# EAGLE schematic trig3_board_de0-nano_lvds (EAGLE 9.6.2)
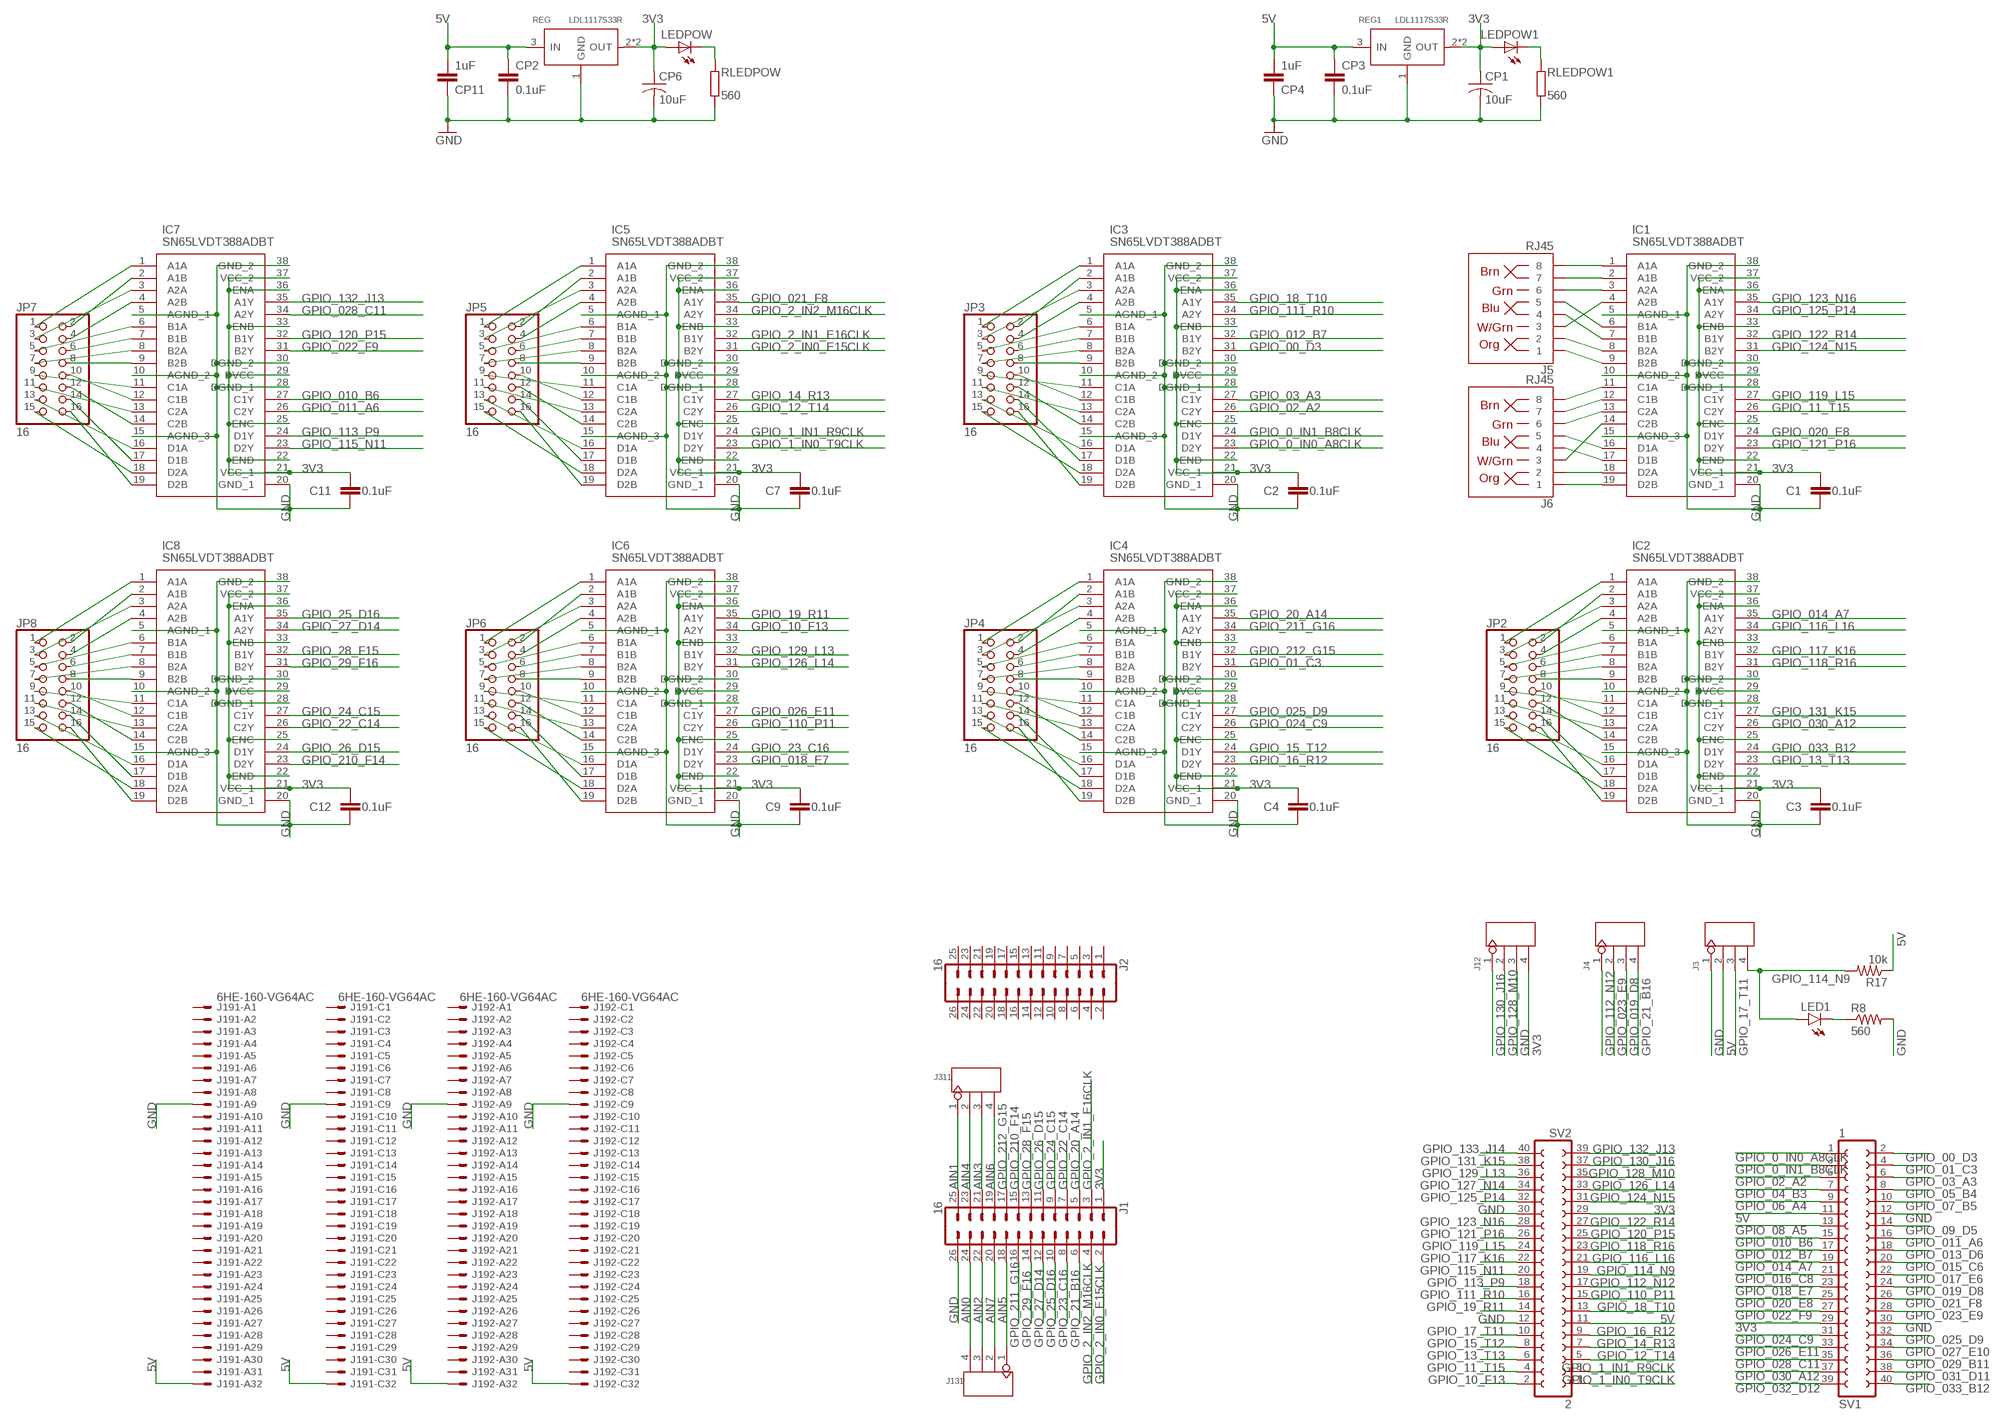
[diagram p0: schematic, sheet 1, part 1 of 2]
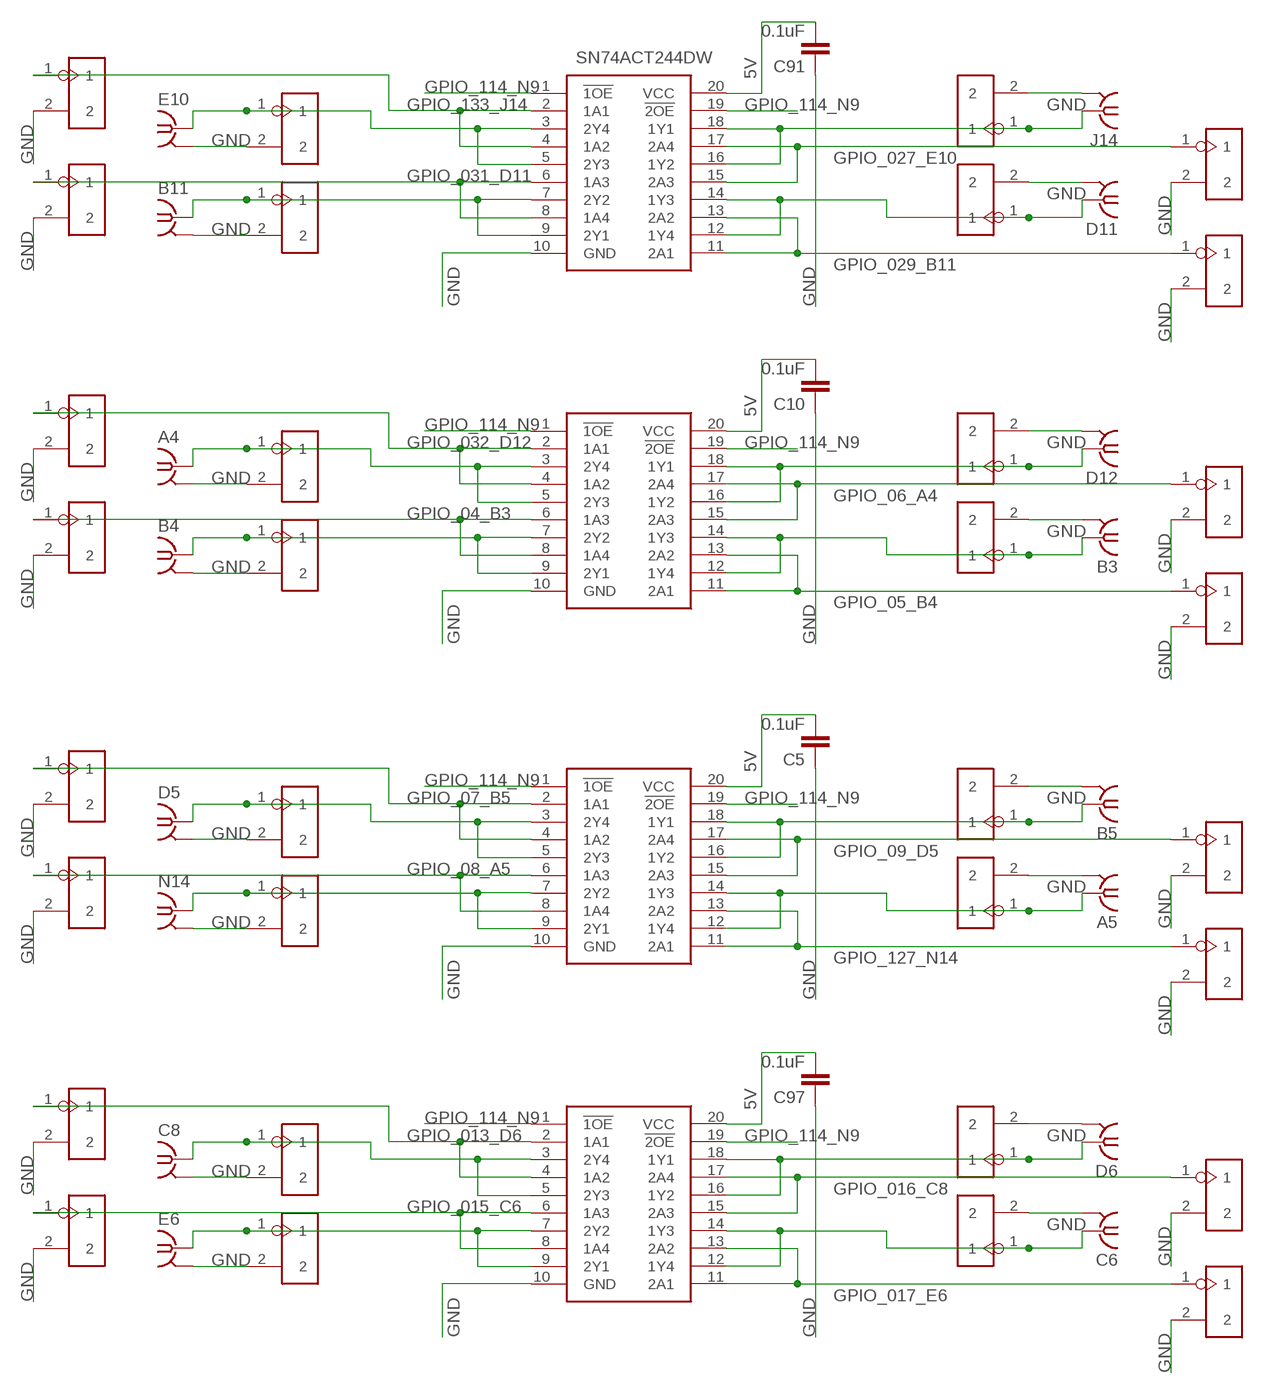
[diagram p1: schematic, sheet 1, part 2 of 2]

## Parts
A4  BU-SMB-V  [BU-SMB-V]
A5  BU-SMB-V  [BU-SMB-V]
B3  BU-SMB-V  [BU-SMB-V]
B4  BU-SMB-V  [BU-SMB-V]
B5  BU-SMB-V  [BU-SMB-V]
B11  BU-SMB-V  [BU-SMB-V]
C1  0.1uF  CAP0805  [0805]
C2  0.1uF  CAP0805  [0805]
C3  0.1uF  CAP0805  [0805]
C4  0.1uF  CAP0805  [0805]
C5  0.1uF  CAP0805  [0805]
C6  BU-SMB-V  [BU-SMB-V]
C7  0.1uF  CAP0805  [0805]
C8  BU-SMB-V  [BU-SMB-V]
C9  0.1uF  CAP0805  [0805]
C10  0.1uF  CAP0805  [0805]
C11  0.1uF  CAP0805  [0805]
C12  0.1uF  CAP0805  [0805]
C91  0.1uF  CAP0805  [0805]
C97  0.1uF  CAP0805  [0805]
CP1  10uF  C-USC1206  [C1206]
CP2  0.1uF  C-EUC0805K  [C0805K]
CP3  0.1uF  C-EUC0805K  [C0805K]
CP4  1uF  C-EUC0805K  [C0805K]
CP6  10uF  C-USC1206  [C1206]
CP11  1uF  C-EUC0805K  [C0805K]
D5  BU-SMB-V  [BU-SMB-V]
D6  BU-SMB-V  [BU-SMB-V]
D11  BU-SMB-V  [BU-SMB-V]
D12  BU-SMB-V  [BU-SMB-V]
E6  BU-SMB-V  [BU-SMB-V]
E10  BU-SMB-V  [BU-SMB-V]
IC1  SN65LVDT388ADBT  [SOP50P640X120-38N]
IC2  SN65LVDT388ADBT  [SOP50P640X120-38N]
IC3  SN65LVDT388ADBT  [SOP50P640X120-38N]
IC4  SN65LVDT388ADBT  [SOP50P640X120-38N]
IC5  SN65LVDT388ADBT  [SOP50P640X120-38N]
IC6  SN65LVDT388ADBT  [SOP50P640X120-38N]
IC7  SN65LVDT388ADBT  [SOP50P640X120-38N]
IC8  SN65LVDT388ADBT  [SOP50P640X120-38N]
J1  16  M13X22X13  [2X13]
J2  16  M13X22X13  [2X13]
J3  4p-2.54  DIP-BLACK-FEMALE-HEADER-VERT(4P-2.54)  [H4-2.54]
J4  4p-2.54  DIP-BLACK-FEMALE-HEADER-VERT(4P-2.54)  [H4-2.54]
J5  RJ45  RJ45-8PTH  [RJ45-8]
J6  RJ45  RJ45-8PTH  [RJ45-8]
J12  4p-2.54  DIP-BLACK-FEMALE-HEADER-VERT(4P-2.54)  [H4-2.54]
J14  BU-SMB-V  [BU-SMB-V]
J19  6HE-160-VG64AC  [6HE_160-VG64AC]
J131  4p-2.54  DIP-BLACK-FEMALE-HEADER-VERT(4P-2.54)  [H4-2.54]
J311  4p-2.54  DIP-BLACK-FEMALE-HEADER-VERT(4P-2.54)  [H4-2.54]
JP2  16  PINHD-2X8/90  [2X08/90]
JP3  16  PINHD-2X8/90  [2X08/90]
JP4  16  PINHD-2X8/90  [2X08/90]
JP5  16  PINHD-2X8/90  [2X08/90]
JP6  16  PINHD-2X8/90  [2X08/90]
JP7  16  PINHD-2X8/90  [2X08/90]
JP8  16  PINHD-2X8/90  [2X08/90]
LED1  red  LEDCHIP-LED0805  [CHIP-LED0805]
LEDPOW  MF-LED-0805-RED  LEDSML0805  [SML0805]
LEDPOW1  MF-LED-0805-RED  LEDSML0805  [SML0805]
N14  BU-SMB-V  [BU-SMB-V]
OJ1  2p-2.54  DIP-BLACK-MALE-HEADER-VERT(2P-2.54)  [H2-2.54]
OJ2  2p-2.54  DIP-BLACK-MALE-HEADER-VERT(2P-2.54)  [H2-2.54]
OJ3  2p-2.54  DIP-BLACK-MALE-HEADER-VERT(2P-2.54)  [H2-2.54]
OJ4  2p-2.54  DIP-BLACK-MALE-HEADER-VERT(2P-2.54)  [H2-2.54]
OJ5  2p-2.54  DIP-BLACK-MALE-HEADER-VERT(2P-2.54)  [H2-2.54]
OJ6  2p-2.54  DIP-BLACK-MALE-HEADER-VERT(2P-2.54)  [H2-2.54]
OJ7  2p-2.54  DIP-BLACK-MALE-HEADER-VERT(2P-2.54)  [H2-2.54]
OJ8  2p-2.54  DIP-BLACK-MALE-HEADER-VERT(2P-2.54)  [H2-2.54]
OJ49  2p-2.54  DIP-BLACK-MALE-HEADER-VERT(2P-2.54)  [H2-2.54]
OJ50  2p-2.54  DIP-BLACK-MALE-HEADER-VERT(2P-2.54)  [H2-2.54]
OJ51  2p-2.54  DIP-BLACK-MALE-HEADER-VERT(2P-2.54)  [H2-2.54]
OJ52  2p-2.54  DIP-BLACK-MALE-HEADER-VERT(2P-2.54)  [H2-2.54]
OJ53  2p-2.54  DIP-BLACK-MALE-HEADER-VERT(2P-2.54)  [H2-2.54]
OJ54  2p-2.54  DIP-BLACK-MALE-HEADER-VERT(2P-2.54)  [H2-2.54]
OJ55  2p-2.54  DIP-BLACK-MALE-HEADER-VERT(2P-2.54)  [H2-2.54]
OJ56  2p-2.54  DIP-BLACK-MALE-HEADER-VERT(2P-2.54)  [H2-2.54]
OJ65  2p-2.54  DIP-BLACK-MALE-HEADER-VERT(2P-2.54)  [H2-2.54]
OJ66  2p-2.54  DIP-BLACK-MALE-HEADER-VERT(2P-2.54)  [H2-2.54]
OJ67  2p-2.54  DIP-BLACK-MALE-HEADER-VERT(2P-2.54)  [H2-2.54]
OJ68  2p-2.54  DIP-BLACK-MALE-HEADER-VERT(2P-2.54)  [H2-2.54]
OJ69  2p-2.54  DIP-BLACK-MALE-HEADER-VERT(2P-2.54)  [H2-2.54]
OJ70  2p-2.54  DIP-BLACK-MALE-HEADER-VERT(2P-2.54)  [H2-2.54]
OJ71  2p-2.54  DIP-BLACK-MALE-HEADER-VERT(2P-2.54)  [H2-2.54]
OJ72  2p-2.54  DIP-BLACK-MALE-HEADER-VERT(2P-2.54)  [H2-2.54]
OJ89  2p-2.54  DIP-BLACK-MALE-HEADER-VERT(2P-2.54)  [H2-2.54]
OJ90  2p-2.54  DIP-BLACK-MALE-HEADER-VERT(2P-2.54)  [H2-2.54]
OJ91  2p-2.54  DIP-BLACK-MALE-HEADER-VERT(2P-2.54)  [H2-2.54]
OJ92  2p-2.54  DIP-BLACK-MALE-HEADER-VERT(2P-2.54)  [H2-2.54]
OJ93  2p-2.54  DIP-BLACK-MALE-HEADER-VERT(2P-2.54)  [H2-2.54]
OJ94  2p-2.54  DIP-BLACK-MALE-HEADER-VERT(2P-2.54)  [H2-2.54]
OJ95  2p-2.54  DIP-BLACK-MALE-HEADER-VERT(2P-2.54)  [H2-2.54]
OJ96  2p-2.54  DIP-BLACK-MALE-HEADER-VERT(2P-2.54)  [H2-2.54]
R8  560  R-US_R0805  [R0805]
R17  10k  RESISTORAXIAL-0.3  [AXIAL-0.3]
REG  LDL1117S33R  PMIC-CJT1117-3.3(SOT223)  [SOT-223]
REG1  LDL1117S33R  PMIC-CJT1117-3.3(SOT223)  [SOT-223]
RLEDPOW  560  R-EU_R0805  [R0805]
RLEDPOW1  560  R-EU_R0805  [R0805]
SV1  1  FE20-2  [FE20-2]
SV2  2  FE20-2  [FE20-2]
VSLUE  SN74ACT244DW  [SOIC127P1030X265-20N]
VSLUE6  SN74ACT244DW  [SOIC127P1030X265-20N]
VSLUE8  SN74ACT244DW  [SOIC127P1030X265-20N]
VSLUE11  SN74ACT244DW  [SOIC127P1030X265-20N]

## Nets
3V3 [power]: C1.2 C2.2 C3.2 C4.2 C7.2 C9.2 C11.2 C12.2 CP1.1 CP6.1 IC1.21(VCC_1) IC1.22(END) IC1.25(ENC) IC1.29(DVCC) IC1.33(ENB) IC1.36(ENA) IC1.37(VCC_2) IC2.21(VCC_1) IC2.22(END) IC2.25(ENC) IC2.29(DVCC) IC2.33(ENB) IC2.36(ENA) IC2.37(VCC_2) IC3.21(VCC_1) IC3.22(END) IC3.25(ENC) IC3.29(DVCC) IC3.33(ENB) IC3.36(ENA) IC3.37(VCC_2) IC4.21(VCC_1) IC4.22(END) IC4.25(ENC) IC4.29(DVCC) IC4.33(ENB) IC4.36(ENA) IC4.37(VCC_2) IC5.21(VCC_1) IC5.22(END) IC5.25(ENC) IC5.29(DVCC) IC5.33(ENB) IC5.36(ENA) IC5.37(VCC_2) IC6.21(VCC_1) IC6.22(END) IC6.25(ENC) IC6.29(DVCC) IC6.33(ENB) IC6.36(ENA) IC6.37(VCC_2) IC7.21(VCC_1) IC7.22(END) IC7.25(ENC) IC7.29(DVCC) IC7.33(ENB) IC7.36(ENA) IC7.37(VCC_2) IC8.21(VCC_1) IC8.22(END) IC8.25(ENC) IC8.29(DVCC) IC8.33(ENB) IC8.36(ENA) IC8.37(VCC_2) J1.1 J12.4 LEDPOW1.A LEDPOW.A REG1.2(OUT) REG1.TER(OUT) REG.2(OUT) REG.TER(OUT) SV1.29 SV2.29
5V [power]: C5.2 C10.2 C91.2 C97.2 CP2.1 CP3.1 CP4.2 CP11.2 J3.2 J19.1-A32 J19.1-C32 J19.2-A32 J19.2-C32 R17.P$1 REG1.3(IN) REG.3(IN) SV1.11 SV2.11 VSLUE6.20(VCC) VSLUE8.20(VCC) VSLUE11.20(VCC) VSLUE.20(VCC)
AIN0: J1.24 J131.4
AIN1: J1.25 J311.1
AIN2: J1.22 J131.3
AIN3: J1.21 J311.3
AIN4: J1.23 J311.2
AIN5: J1.18 J131.1
AIN6: J1.19 J311.4
AIN7: J1.20 J131.2
GND [power]: A4.2 A4.3 A4.4 A4.5 A5.2 A5.3 A5.4 A5.5 B3.2 B3.3 B3.4 B3.5 B4.2 B4.3 B4.4 B4.5 B5.2 B5.3 B5.4 B5.5 B11.2 B11.3 B11.4 B11.5 C1.1 C2.1 C3.1 C4.1 C5.1 C6.2 C6.3 C6.4 C6.5 C7.1 C8.2 C8.3 C8.4 C8.5 C9.1 C10.1 C11.1 C12.1 C91.1 C97.1 CP1.2 CP2.2 CP3.2 CP4.1 CP6.2 CP11.1 D5.2 D5.3 D5.4 D5.5 D6.2 D6.3 D6.4 D6.5 D11.2 D11.3 D11.4 D11.5 D12.2 D12.3 D12.4 D12.5 E6.2 E6.3 E6.4 E6.5 E10.2 E10.3 E10.4 E10.5 IC1.5(AGND_1) IC1.10(AGND_2) IC1.15(AGND_3) IC1.20(GND_1) IC1.28(DGND_1) IC1.30(DGND_2) IC1.38(GND_2) IC2.5(AGND_1) IC2.10(AGND_2) IC2.15(AGND_3) IC2.20(GND_1) IC2.28(DGND_1) IC2.30(DGND_2) IC2.38(GND_2) IC3.5(AGND_1) IC3.10(AGND_2) IC3.15(AGND_3) IC3.20(GND_1) IC3.28(DGND_1) IC3.30(DGND_2) IC3.38(GND_2) IC4.5(AGND_1) IC4.10(AGND_2) IC4.15(AGND_3) IC4.20(GND_1) IC4.28(DGND_1) IC4.30(DGND_2) IC4.38(GND_2) IC5.5(AGND_1) IC5.10(AGND_2) IC5.15(AGND_3) IC5.20(GND_1) IC5.28(DGND_1) IC5.30(DGND_2) IC5.38(GND_2) IC6.5(AGND_1) IC6.10(AGND_2) IC6.15(AGND_3) IC6.20(GND_1) IC6.28(DGND_1) IC6.30(DGND_2) IC6.38(GND_2) IC7.5(AGND_1) IC7.10(AGND_2) IC7.15(AGND_3) IC7.20(GND_1) IC7.28(DGND_1) IC7.30(DGND_2) IC7.38(GND_2) IC8.5(AGND_1) IC8.10(AGND_2) IC8.15(AGND_3) IC8.20(GND_1) IC8.28(DGND_1) IC8.30(DGND_2) IC8.38(GND_2) J1.26 J3.1 J12.3 J14.2 J14.3 J14.4 J14.5 J19.1-A9 J19.1-C9 J19.2-A9 J19.2-C9 N14.2 N14.3 N14.4 N14.5 OJ1.2 OJ2.2 OJ3.2 OJ4.2 OJ5.2 OJ6.2 OJ7.2 OJ8.2 OJ49.2 OJ50.2 OJ51.2 OJ52.2 OJ53.2 OJ54.2 OJ55.2 OJ56.2 OJ65.2 OJ66.2 OJ67.2 OJ68.2 OJ69.2 OJ70.2 OJ71.2 OJ72.2 OJ89.2 OJ90.2 OJ91.2 OJ92.2 OJ93.2 OJ94.2 OJ95.2 OJ96.2 R8.2 REG1.1(GND) REG.1(GND) RLEDPOW1.2 RLEDPOW.2 SV1.12 SV1.30 SV2.12 SV2.30 VSLUE6.10(GND) VSLUE8.10(GND) VSLUE11.10(GND) VSLUE.10(GND)
GPIO_00_D3: IC3.31(B2Y) SV1.2
GPIO_0_IN0_A8CLK: IC3.23(D2Y) SV1.1
GPIO_0_IN1_B8CLK: IC3.24(D1Y) SV1.3
GPIO_01_C3: IC4.31(B2Y) SV1.4
GPIO_1_IN0_T9CLK: IC5.23(D2Y) SV2.1
GPIO_1_IN1_R9CLK: IC5.24(D1Y) SV2.3
GPIO_02_A2: IC3.26(C2Y) SV1.5
GPIO_2_IN0_E15CLK: IC5.31(B2Y) J1.2
GPIO_2_IN1_E16CLK: IC5.32(B1Y) J1.3
GPIO_2_IN2_M16CLK: IC5.34(A2Y) J1.4
GPIO_03_A3: IC3.27(C1Y) SV1.6
GPIO_04_B3: OJ96.1 SV1.7 VSLUE11.6(1A3) VSLUE11.8(1A4)
GPIO_05_B4: OJ94.1 SV1.8 VSLUE11.11(2A1) VSLUE11.13(2A2)
GPIO_06_A4: OJ93.1 SV1.9 VSLUE11.15(2A3) VSLUE11.17(2A4)
GPIO_07_B5: OJ71.1 SV1.10 VSLUE8.2(1A1) VSLUE8.4(1A2)
GPIO_08_A5: OJ72.1 SV1.13 VSLUE8.6(1A3) VSLUE8.8(1A4)
GPIO_09_D5: OJ69.1 SV1.14 VSLUE8.15(2A3) VSLUE8.17(2A4)
GPIO_010_B6: IC7.27(C1Y) SV1.15
GPIO_10_F13: IC6.34(A2Y) SV2.2
GPIO_011_A6: IC7.26(C2Y) SV1.16
GPIO_11_T15: IC1.26(C2Y) SV2.4
GPIO_012_B7: IC3.32(B1Y) SV1.17
GPIO_12_T14: IC5.26(C2Y) SV2.5
GPIO_013_D6: OJ55.1 SV1.18 VSLUE6.2(1A1) VSLUE6.4(1A2)
GPIO_13_T13: IC2.23(D2Y) SV2.6
GPIO_014_A7: IC2.35(A1Y) SV1.19
GPIO_14_R13: IC5.27(C1Y) SV2.7
GPIO_015_C6: OJ56.1 SV1.20 VSLUE6.6(1A3) VSLUE6.8(1A4)
GPIO_15_T12: IC4.24(D1Y) SV2.8
GPIO_016_C8: OJ53.1 SV1.21 VSLUE6.15(2A3) VSLUE6.17(2A4)
GPIO_16_R12: IC4.23(D2Y) SV2.9
GPIO_017_E6: OJ54.1 SV1.22 VSLUE6.11(2A1) VSLUE6.13(2A2)
GPIO_17_T11: J3.3 SV2.10
GPIO_018_E7: IC6.23(D2Y) SV1.23
GPIO_18_T10: IC3.35(A1Y) SV2.13
GPIO_019_D8: J4.3 SV1.24
GPIO_19_R11: IC6.35(A1Y) SV2.14
GPIO_20_A14: IC4.35(A1Y) J1.5
GPIO_020_E8: IC1.24(D1Y) SV1.25
GPIO_21_B16: J1.6 J4.4
GPIO_021_F8: IC5.35(A1Y) SV1.26
GPIO_22_C14: IC8.26(C2Y) J1.7
GPIO_022_F9: IC7.31(B2Y) SV1.27
GPIO_23_C16: IC6.24(D1Y) J1.8
GPIO_023_E9: J4.2 SV1.28
GPIO_024_C9: IC4.26(C2Y) SV1.31
GPIO_24_C15: IC8.27(C1Y) J1.9
GPIO_025_D9: IC4.27(C1Y) SV1.32
GPIO_25_D16: IC8.35(A1Y) J1.10
GPIO_26_D15: IC8.24(D1Y) J1.11
GPIO_026_E11: IC6.27(C1Y) SV1.33
GPIO_27_D14: IC8.34(A2Y) J1.12
GPIO_027_E10: OJ5.1 SV1.34 VSLUE.15(2A3) VSLUE.17(2A4)
GPIO_028_C11: IC7.34(A2Y) SV1.35
GPIO_28_F15: IC8.32(B1Y) J1.13
GPIO_029_B11: OJ6.1 SV1.36 VSLUE.11(2A1) VSLUE.13(2A2)
GPIO_29_F16: IC8.31(B2Y) J1.14
GPIO_030_A12: IC2.26(C2Y) SV1.37
GPIO_031_D11: OJ8.1 SV1.38 VSLUE.6(1A3) VSLUE.8(1A4)
GPIO_032_D12: OJ95.1 SV1.39 VSLUE11.2(1A1) VSLUE11.4(1A2)
GPIO_033_B12: IC2.24(D1Y) SV1.40
GPIO_110_P11: IC6.26(C2Y) SV2.15
GPIO_111_R10: IC3.34(A2Y) SV2.16
GPIO_112_N12: J4.1 SV2.17
GPIO_113_P9: IC7.24(D1Y) SV2.18
GPIO_114_N9: J3.4 LED1.A R17.P$2 SV2.19 VSLUE6.1(!1OE) VSLUE6.19(!2OE) VSLUE8.1(!1OE) VSLUE8.19(!2OE) VSLUE11.1(!1OE) VSLUE11.19(!2OE) VSLUE.1(!1OE) VSLUE.19(!2OE)
GPIO_115_N11: IC7.23(D2Y) SV2.20
GPIO_116_L16: IC2.34(A2Y) SV2.21
GPIO_117_K16: IC2.32(B1Y) SV2.22
GPIO_118_R16: IC2.31(B2Y) SV2.23
GPIO_119_L15: IC1.27(C1Y) SV2.24
GPIO_120_P15: IC7.32(B1Y) SV2.25
GPIO_121_P16: IC1.23(D2Y) SV2.26
GPIO_122_R14: IC1.32(B1Y) SV2.27
GPIO_123_N16: IC1.35(A1Y) SV2.28
GPIO_124_N15: IC1.31(B2Y) SV2.31
GPIO_125_P14: IC1.34(A2Y) SV2.32
GPIO_126_L14: IC6.31(B2Y) SV2.33
GPIO_127_N14: OJ70.1 SV2.34 VSLUE8.11(2A1) VSLUE8.13(2A2)
GPIO_128_M10: J12.2 SV2.35
GPIO_129_L13: IC6.32(B1Y) SV2.36
GPIO_130_J16: J12.1 SV2.37
GPIO_131_K15: IC2.27(C1Y) SV2.38
GPIO_132_J13: IC7.35(A1Y) SV2.39
GPIO_133_J14: OJ7.1 SV2.40 VSLUE.2(1A1) VSLUE.4(1A2)
GPIO_210_F14: IC8.23(D2Y) J1.15
GPIO_211_G16: IC4.34(A2Y) J1.16
GPIO_212_G15: IC4.32(B1Y) J1.17
N$1: IC1.1(A1A) J5.8
N$2: IC1.2(A1B) J5.7
N$3: IC1.3(A2A) J5.6
N$4: IC2.1(A1A) JP2.1
N$5: IC1.4(A2B) J5.3
N$6: IC1.6(B1A) J5.5
N$7: IC1.7(B1B) J5.4
N$8: IC1.8(B2A) J5.2
N$9: LED1.C R8.1
N$10: IC1.9(B2B) J5.1
N$11: IC1.11(C1A) J6.8
N$12: IC1.12(C1B) J6.7
N$13: IC1.13(C2A) J6.6
N$14: IC1.14(C2B) J6.3
N$15: IC1.16(D1A) J6.5
N$16: IC1.17(D1B) J6.4
N$17: IC1.18(D2A) J6.2
N$18: IC1.19(D2B) J6.1
N$21: IC2.2(A1B) JP2.2
N$22: IC2.3(A2A) JP2.3
N$23: IC2.4(A2B) JP2.4
N$24: IC2.6(B1A) JP2.5
N$25: IC2.7(B1B) JP2.6
N$26: IC2.8(B2A) JP2.7
N$27: IC2.9(B2B) JP2.8
N$28: IC2.11(C1A) JP2.9
N$29: IC2.12(C1B) JP2.10
N$30: IC2.13(C2A) JP2.11
N$31: IC2.14(C2B) JP2.12
N$32: IC2.16(D1A) JP2.13
N$33: IC2.17(D1B) JP2.14
N$34: IC2.18(D2A) JP2.15
N$35: IC2.19(D2B) JP2.16
N$36: LEDPOW.C RLEDPOW.1
N$37: LEDPOW1.C RLEDPOW1.1
N$44: IC3.1(A1A) JP3.1
N$45: IC3.2(A1B) JP3.2
N$46: IC3.3(A2A) JP3.3
N$47: IC3.4(A2B) JP3.4
N$48: IC3.6(B1A) JP3.5
N$49: IC3.7(B1B) JP3.6
N$50: IC3.8(B2A) JP3.7
N$51: IC3.9(B2B) JP3.8
N$52: IC3.11(C1A) JP3.9
N$53: IC3.12(C1B) JP3.10
N$54: IC3.13(C2A) JP3.11
N$55: IC3.14(C2B) JP3.12
N$56: IC3.16(D1A) JP3.13
N$57: IC3.17(D1B) JP3.14
N$58: IC3.18(D2A) JP3.15
N$59: IC3.19(D2B) JP3.16
N$60: IC4.1(A1A) JP4.1
N$61: IC4.2(A1B) JP4.2
N$62: IC4.3(A2A) JP4.3
N$63: IC4.4(A2B) JP4.4
N$64: IC4.6(B1A) JP4.5
N$65: IC4.7(B1B) JP4.6
N$66: IC4.8(B2A) JP4.7
N$67: IC4.9(B2B) JP4.8
N$68: IC4.11(C1A) JP4.9
N$69: IC4.12(C1B) JP4.10
N$70: IC4.13(C2A) JP4.11
N$71: IC4.14(C2B) JP4.12
N$72: IC4.16(D1A) JP4.13
N$73: IC4.17(D1B) JP4.14
N$74: IC4.18(D2A) JP4.15
N$75: IC4.19(D2B) JP4.16
N$78: IC5.1(A1A) JP5.1
N$79: IC5.2(A1B) JP5.2
N$80: IC5.3(A2A) JP5.3
N$81: IC5.4(A2B) JP5.4
N$82: IC5.6(B1A) JP5.5
N$83: IC5.7(B1B) JP5.6
N$84: IC5.8(B2A) JP5.7
N$85: IC5.9(B2B) JP5.8
N$86: IC5.11(C1A) JP5.9
N$87: IC5.12(C1B) JP5.10
N$88: IC5.13(C2A) JP5.11
N$89: IC5.14(C2B) JP5.12
N$90: IC5.16(D1A) JP5.13
N$91: IC5.17(D1B) JP5.14
N$92: IC5.18(D2A) JP5.15
N$93: IC5.19(D2B) JP5.16
N$94: IC6.1(A1A) JP6.1
N$95: IC6.2(A1B) JP6.2
N$96: IC6.3(A2A) JP6.3
N$97: IC6.4(A2B) JP6.4
N$98: IC6.6(B1A) JP6.5
N$99: IC6.7(B1B) JP6.6
N$100: IC6.8(B2A) JP6.7
N$101: IC6.9(B2B) JP6.8
N$102: IC6.11(C1A) JP6.9
N$103: IC6.12(C1B) JP6.10
N$104: IC6.13(C2A) JP6.11
N$105: IC6.14(C2B) JP6.12
N$106: IC6.16(D1A) JP6.13
N$107: IC6.17(D1B) JP6.14
N$108: IC6.18(D2A) JP6.15
N$109: IC6.19(D2B) JP6.16
N$112: IC7.1(A1A) JP7.1
N$113: IC7.2(A1B) JP7.2
N$114: IC7.3(A2A) JP7.3
N$115: IC7.4(A2B) JP7.4
N$116: IC7.6(B1A) JP7.5
N$117: IC7.7(B1B) JP7.6
N$118: IC7.8(B2A) JP7.7
N$119: IC7.9(B2B) JP7.8
N$120: IC7.11(C1A) JP7.9
N$121: IC7.12(C1B) JP7.10
N$122: IC7.13(C2A) JP7.11
N$123: IC7.14(C2B) JP7.12
N$124: IC7.16(D1A) JP7.13
N$125: IC7.17(D1B) JP7.14
N$126: IC7.18(D2A) JP7.15
N$127: IC7.19(D2B) JP7.16
N$128: IC8.1(A1A) JP8.1
N$129: IC8.2(A1B) JP8.2
N$130: IC8.3(A2A) JP8.3
N$131: IC8.4(A2B) JP8.4
N$132: IC8.6(B1A) JP8.5
N$133: IC8.7(B1B) JP8.6
N$134: IC8.8(B2A) JP8.7
N$135: IC8.9(B2B) JP8.8
N$136: IC8.11(C1A) JP8.9
N$137: IC8.12(C1B) JP8.10
N$138: IC8.13(C2A) JP8.11
N$139: IC8.14(C2B) JP8.12
N$140: IC8.16(D1A) JP8.13
N$141: IC8.17(D1B) JP8.14
N$142: IC8.18(D2A) JP8.15
N$143: IC8.19(D2B) JP8.16
OUT1: J14.1 OJ1.1 VSLUE.16(1Y2) VSLUE.18(1Y1)
OUT2: D11.1 OJ2.1 VSLUE.12(1Y4) VSLUE.14(1Y3)
OUT3: B11.1 OJ3.1 VSLUE.7(2Y2) VSLUE.9(2Y1)
OUT4: E10.1 OJ4.1 VSLUE.3(2Y4) VSLUE.5(2Y3)
OUT25: D6.1 OJ52.1 VSLUE6.16(1Y2) VSLUE6.18(1Y1)
OUT26: C6.1 OJ51.1 VSLUE6.12(1Y4) VSLUE6.14(1Y3)
OUT27: C8.1 OJ49.1 VSLUE6.3(2Y4) VSLUE6.5(2Y3)
OUT28: E6.1 OJ50.1 VSLUE6.7(2Y2) VSLUE6.9(2Y1)
OUT33: B5.1 OJ68.1 VSLUE8.16(1Y2) VSLUE8.18(1Y1)
OUT34: A5.1 OJ67.1 VSLUE8.12(1Y4) VSLUE8.14(1Y3)
OUT35: D5.1 OJ65.1 VSLUE8.3(2Y4) VSLUE8.5(2Y3)
OUT36: N14.1 OJ66.1 VSLUE8.7(2Y2) VSLUE8.9(2Y1)
OUT45: D12.1 OJ92.1 VSLUE11.16(1Y2) VSLUE11.18(1Y1)
OUT46: B3.1 OJ91.1 VSLUE11.12(1Y4) VSLUE11.14(1Y3)
OUT47: A4.1 OJ89.1 VSLUE11.3(2Y4) VSLUE11.5(2Y3)
OUT48: B4.1 OJ90.1 VSLUE11.7(2Y2) VSLUE11.9(2Y1)
Unconnected: J2.1 J2.2 J2.3 J2.4 J2.5 J2.6 J2.7 J2.8 J2.9 J2.10 J2.11 J2.12 J2.13 J2.14 J2.15 J2.16 J2.17 J2.18 J2.19 J2.20 J2.21 J2.22 J2.23 J2.24 J2.25 J2.26 J19.1-A1 J19.1-A2 J19.1-A3 J19.1-A4 J19.1-A5 J19.1-A6 J19.1-A7 J19.1-A8 J19.1-A10 J19.1-A11 J19.1-A12 J19.1-A13 J19.1-A14 J19.1-A15 J19.1-A16 J19.1-A17 J19.1-A18 J19.1-A19 J19.1-A20 J19.1-A21 J19.1-A22 J19.1-A23 J19.1-A24 J19.1-A25 J19.1-A26 J19.1-A27 J19.1-A28 J19.1-A29 J19.1-A30 J19.1-A31 J19.1-C1 J19.1-C2 J19.1-C3 J19.1-C4 J19.1-C5 J19.1-C6 J19.1-C7 J19.1-C8 J19.1-C10 J19.1-C11 J19.1-C12 J19.1-C13 J19.1-C14 J19.1-C15 J19.1-C16 J19.1-C17 J19.1-C18 J19.1-C19 J19.1-C20 J19.1-C21 J19.1-C22 J19.1-C23 J19.1-C24 J19.1-C25 J19.1-C26 J19.1-C27 J19.1-C28 J19.1-C29 J19.1-C30 J19.1-C31 J19.2-A1 J19.2-A2 J19.2-A3 J19.2-A4 J19.2-A5 J19.2-A6 J19.2-A7 J19.2-A8 J19.2-A10 J19.2-A11 J19.2-A12 J19.2-A13 J19.2-A14 J19.2-A15 J19.2-A16 J19.2-A17 J19.2-A18 J19.2-A19 J19.2-A20 J19.2-A21 J19.2-A22 J19.2-A23 J19.2-A24 J19.2-A25 J19.2-A26 J19.2-A27 J19.2-A28 J19.2-A29 J19.2-A30 J19.2-A31 J19.2-C1 J19.2-C2 J19.2-C3 J19.2-C4 J19.2-C5 J19.2-C6 J19.2-C7 J19.2-C8 J19.2-C10 J19.2-C11 J19.2-C12 J19.2-C13 J19.2-C14 J19.2-C15 J19.2-C16 J19.2-C17 J19.2-C18 J19.2-C19 J19.2-C20 J19.2-C21 J19.2-C22 J19.2-C23 J19.2-C24 J19.2-C25 J19.2-C26 J19.2-C27 J19.2-C28 J19.2-C29 J19.2-C30 J19.2-C31

## Library data of the parts
A4 A5 B3-B5 B11 C6 C8 D5 D6 D11 D12 E6 E10 J14 N14 = con-coax:BU-SMB-V: FEMALE SMB CONNECTOR Radiall distributor RS 112-2993; OC_FARNELL: unknown; OC_NEWARK: unknown
C1-C5 C7 C9-C12 C91 C97 = SparkFun-Capacitors:CAP: Capacitor Standard 0603 ceramic capacitor, and 0.1" leaded capacitor.
CP1 CP6 = rcl@1:C-US: CAPACITOR, American symbol; MPN: MF-CAP-1206-10uF
CP2 CP3 = rcl:C-EU: CAPACITOR, European symbol; MPN: MF-CAP-0805-0.1uF
CP4 CP11 = rcl:C-EU: CAPACITOR, European symbol; MPN: MF-CAP-0805-1uF
IC1-IC8 = SamacSys_Parts:SN65LVDT388ADBT: Texas Instruments SN65LVDT388ADBT, LVDS Receiver, 3 3.6 V, 38-Pin, TSSOP Source: Datasheet <http://www.ti.com/lit/gpn/sn65lvdt388a>; DESCRIPTION: Texas Instruments SN65LVDT388ADBT, LVDS Receiver, 3 3.6 V, 38-Pin, TSSOP; HEIGHT: 1.2mm; MANUFACTURER_NAME: Texas Instruments; MANUFACTURER_PART_NUMBER: SN65LVDT388ADBT; MOUSER_PART_NUMBER: 595-SN65LVDT388ADBT; MOUSER_PRICE-STOCK: https://www.mouser.co.uk/ProductDetail/Texas-Instruments/SN65LVDT388ADBT?qs=QViXGNcIEAthmCAzU7rtXw%3D%3D
J1 J2 = SparkFun-Connectors:M13X2: 0.1" spaced headers
J3 J4 J12 J131 J311 = Seeed-Connector:DIP-BLACK-FEMALE-HEADER-VERT(4P-2.54): 320030017; MPN: F185-1104A1BSYA1
J5 J6 = SparkFun-Connectors:RJ45-8: RJ45 Jack Simple RJ45, 8-pin connection - connector for common Cat5, Cat5e, and Cat6 Ethernet cables. Footprint not yet proven in production. Connector sku is PRT-00643; Breakout PCB sku is BOB-00716.; PROD_ID: CONN-08506
J19 = 19inch:6HE-?-VG64AC: Euro Card with 2 x VG-64 AC connector
JP2-JP8 = pinhead:PINHD-2X8: PIN HEADER
LED1 = led:LED: LED OSRAM: - CHIPLED LG R971, LG N971, LY N971, LG Q971, LY Q971, LO R971, LY R971 LH N974, LH R974 LS Q976, LO Q976, LY Q976 LO Q996 - Hyper CHIPLED LW Q18S LB Q993, LB Q99A, LB R99A - SideLED LS A670, LO A670, LY A670, LG A670, LP A670 LB A673, LV A673, LT A673, LW A673 LH A674 LY A675 LS A676, LA A676, LO A676, LY A676, LW A676 LS A679, LY A679, LG A679 - Hyper Micro SIDELED® LS Y876, LA Y876, LO Y876, LY Y876 LT Y87S - SmartLED LW L88C, LW L88S LB L89C, LB L89S, LG L890 LS L89K, LO L89K, LY L89K LS L896, LA L896, LO L896, LY L896 - TOPLED LS T670, LO T670, LY T670, LG T670, LP T670 LSG T670, LSP T670, LSY T670, LOP T670, LYG T670 LG T671, LOG T671, LSG T671 LB T673, LV T673, LT T673, LW T673 LH T674 LS T676, LA T676, LO T676, LY T676, LB T676, LH T676, LSB T676, LW T676 LB T67C, LV T67C, LT T67C, LS T67K, LO T67K, LY T67K, LW E67C LS E67B, LA E67B, LO E67B, LY E67B, LB E67C, LV E67C, LT E67C LW T67C LS T679, LY T679, LG T679 LS T770, LO T770, LY T770, LG T770, LP T770 LB T773, LV T773, LT T773, LW T773 LH T774 LS E675, LA E675, LY E675, LS T675 LS T776, LA T776, LO T776, LY T776, LB T776 LHGB T686 LT T68C, LB T68C - Hyper Mini TOPLED® LB M676 - Mini TOPLED Santana® LG M470 LS M47K, LO M47K, LY M47K Source: http://www.osram.convergy.de LUXEON: - LUMILED® LXK2-PW12-R00, LXK2-PW12-S00, LXK2-PW14-U00, LXK2-PW14-V00 LXK2-PM12-R00, LXK2-PM12-S00, LXK2-PM14-U00 LXK2-PE12-Q00, LXK2-PE12-R00, LXK2-PE12-S00, LXK2-PE14-T00, LXK2-PE14-U00 LXK2-PB12-K00, LXK2-PB12-L00, LXK2-PB12-M00, LXK2-PB14-N00, LXK2-PB14-P00, LXK2-PB14-Q00 LXK2-PR12-L00, LXK2-PR12-M00, LXK2-PR14-Q00, LXK2-PR14-R00 LXK2-PD12-Q00, LXK2-PD12-R00, LXK2-PD12-S00 LXK2-PH12-R00, LXK2-PH12-S00 LXK2-PL12-P00, LXK2-PL12-Q00, LXK2-PL12-R00 Source: www.luxeon.com KINGBRIGHT: KA-3528ASYC Source: www.kingbright.com
LEDPOW LEDPOW1 = led:LED: LED OSRAM: - CHIPLED LG R971, LG N971, LY N971, LG Q971, LY Q971, LO R971, LY R971 LH N974, LH R974 LS Q976, LO Q976, LY Q976 LO Q996 - Hyper CHIPLED LW Q18S LB Q993, LB Q99A, LB R99A - SideLED LS A670, LO A670, LY A670, LG A670, LP A670 LB A673, LV A673, LT A673, LW A673 LH A674 LY A675 LS A676, LA A676, LO A676, LY A676, LW A676 LS A679, LY A679, LG A679 - Hyper Micro SIDELED® LS Y876, LA Y876, LO Y876, LY Y876 LT Y87S - SmartLED LW L88C, LW L88S LB L89C, LB L89S, LG L890 LS L89K, LO L89K, LY L89K LS L896, LA L896, LO L896, LY L896 - TOPLED LS T670, LO T670, LY T670, LG T670, LP T670 LSG T670, LSP T670, LSY T670, LOP T670, LYG T670 LG T671, LOG T671, LSG T671 LB T673, LV T673, LT T673, LW T673 LH T674 LS T676, LA T676, LO T676, LY T676, LB T676, LH T676, LSB T676, LW T676 LB T67C, LV T67C, LT T67C, LS T67K, LO T67K, LY T67K, LW E67C LS E67B, LA E67B, LO E67B, LY E67B, LB E67C, LV E67C, LT E67C LW T67C LS T679, LY T679, LG T679 LS T770, LO T770, LY T770, LG T770, LP T770 LB T773, LV T773, LT T773, LW T773 LH T774 LS E675, LA E675, LY E675, LS T675 LS T776, LA T776, LO T776, LY T776, LB T776 LHGB T686 LT T68C, LB T68C - Hyper Mini TOPLED® LB M676 - Mini TOPLED Santana® LG M470 LS M47K, LO M47K, LY M47K Source: http://www.osram.convergy.de LUXEON: - LUMILED® LXK2-PW12-R00, LXK2-PW12-S00, LXK2-PW14-U00, LXK2-PW14-V00 LXK2-PM12-R00, LXK2-PM12-S00, LXK2-PM14-U00 LXK2-PE12-Q00, LXK2-PE12-R00, LXK2-PE12-S00, LXK2-PE14-T00, LXK2-PE14-U00 LXK2-PB12-K00, LXK2-PB12-L00, LXK2-PB12-M00, LXK2-PB14-N00, LXK2-PB14-P00, LXK2-PB14-Q00 LXK2-PR12-L00, LXK2-PR12-M00, LXK2-PR14-Q00, LXK2-PR14-R00 LXK2-PD12-Q00, LXK2-PD12-R00, LXK2-PD12-S00 LXK2-PH12-R00, LXK2-PH12-S00 LXK2-PL12-P00, LXK2-PL12-Q00, LXK2-PL12-R00 Source: www.luxeon.com KINGBRIGHT: KA-3528ASYC Source: www.kingbright.com; MPN: MF-LED-0805-RED; OC_NEWARK: unknown
OJ1-OJ8 OJ49-OJ56 OJ65-OJ72 OJ89-OJ96 = Seeed-Connector:DIP-BLACK-MALE-HEADER-VERT(2P-2.54): 320020016; MPN: P125-1102A0BS116A1
R8 = resistor:R-US_: RESISTOR, American symbol
R17 = SparkFun-Passives:RESISTOR: Resistor Basic schematic elements and footprints for 0603, 1206, and PTH resistors.
REG REG1 = Seeed-IC-2016:PMIC-CJT1117-3.3(SOT223): 310030097; MPN: LDL1117S33R; VALUE: CJT1117-3.3-SOT223
RLEDPOW RLEDPOW1 = resistor:R-EU_: RESISTOR, European symbol; MPN: MF-RES-0805-560; OC_NEWARK: unknown
SV1 SV2 = con-lsta:FE20-2: FEMALE HEADER; OC_FARNELL: unknown; OC_NEWARK: unknown
VSLUE VSLUE6 VSLUE8 VSLUE11 = SN74ACT244DW:SN74ACT244DW: SN74ACT244DW, 8-Bit Buffer, Line Driver, ACT, 3-State Non-Inverting 4.5 5.5 V 20-Pin SOIC Source: Datasheet <http://www.ti.com/lit/ds/symlink/sn74act244.pdf>; ARROW_PART_NUMBER: SN74ACT244DW; ARROW_PRICE-STOCK: https://www.arrow.com/en/products/sn74act244dw/texas-instruments; DESCRIPTION: SN74ACT244DW, 8-Bit Buffer, Line Driver, ACT, 3-State Non-Inverting 4.5 5.5 V 20-Pin SOIC; HEIGHT: 2.65mm; MANUFACTURER_NAME: Texas Instruments; MANUFACTURER_PART_NUMBER: SN74ACT244DW; RS_PART_NUMBER: 4363169; RS_PRICE-STOCK: http://uk.rs-online.com/web/p/products/4363169

## Net classes
0 default: width 0.254 mm
1 power: width 0.305 mm